# Altium project GSM_PCB_V4.PrjPcb
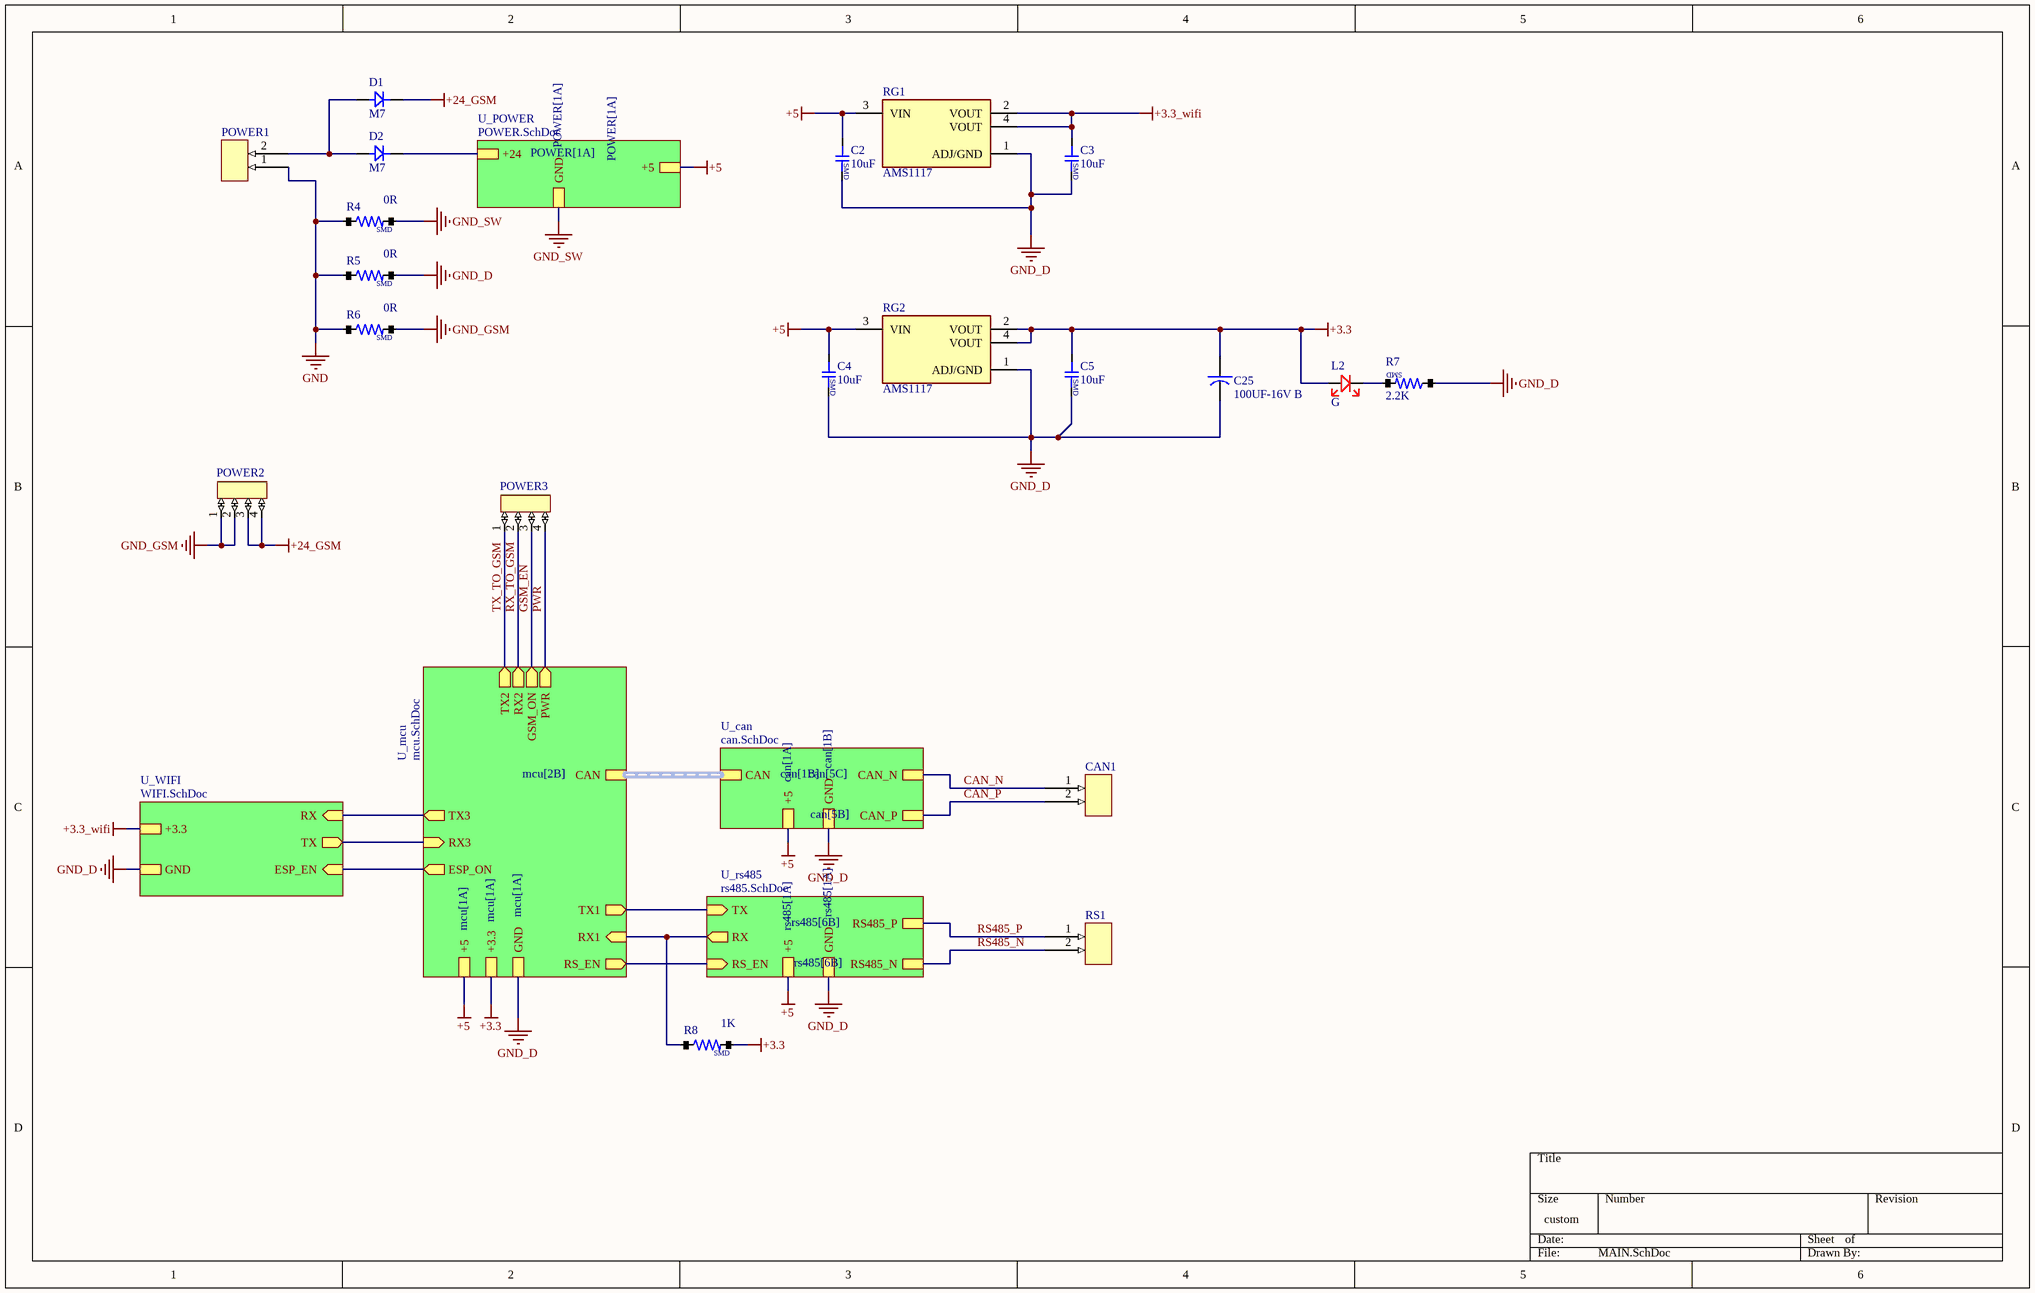
[diagram p0: MAIN.SchDoc]
7 sheets, 89 parts. Net scope: hierarchical (ports join the sheet entries above them; power ports are global).
Board file: GSM_PCB_V4.PcbDoc
Sheets:
  MAIN.SchDoc
    U_POWER = POWER.SchDoc
    U_rs485 = rs485.SchDoc
    U_mcu = mcu.SchDoc
      U_spi_flash = spi_flash.SchDoc
    U_can = can.SchDoc
    U_WIFI = WIFI.SchDoc

## Sheet MAIN.SchDoc
size 381 x 241 mm; SheetNumber: 1; SheetTotal: 7

### Parts
C2  10uF  [CAP-1206]
C3  10uF  [CAP-1206]
C4  10uF  [CAP-1206]
C5  10uF  [CAP-1206]
C25  100UF-16V B  [CAP_TANTAL_B]
CAN1  conector_2pin_power  [MSTBA 2,5]  (value not drawn)
D1  M7  [DIOD/1N4007/SMD]
D2  M7  [DIOD/1N4007/SMD]
L2  G  [LED/0805]
POWER1  (no value)  [CONECTOR/FONIX/2PIN]
POWER2  (no value)  [CONECTOR/XH/4PIN]
POWER3  (no value)  [CONECTOR/XH/4PIN]
R4  0R  [RES/0805]
R5  0R  [RES/0805]
R6  0R  [RES/0805]
R7  2.2K  [RES/0603]
R8  1K  [RES/0603]
RG1  AMS1117  [AMS1117]
RG2  AMS1117  [AMS1117]
RS1  conector_2pin_power  [MSTBA 2,5]  (value not drawn)

### Sub-sheets
U_can = can.SchDoc: GND, +5, CAN (harness CAN), CAN_P, CAN_N
U_mcu = mcu.SchDoc: GND, +5, +3.3, CAN (harness CAN), TX1 (out), RX1 (in), RS_EN (out), TX3 (out), RX3 (in), ESP_ON (out), TX2 (out), RX2 (out), PWR (out), GSM_ON (out)
U_POWER = POWER.SchDoc: GND, +24, +5
U_rs485 = rs485.SchDoc: GND, +5, RS485_N, RS485_P, TX (in), RS_EN (in), RX (out)
U_WIFI = WIFI.SchDoc: +3.3, GND, ESP_EN (in), RX (in), TX (out)

### Nets
+3.3: C3.1 C5.1 C25.+ L2.A R8.2 RG1.2(VOUT) RG1.4(VOUT) RG2.2(VOUT) RG2.4(VOUT) ; sheet U_mcu/+3.3, sheet U_WIFI/+3.3  [also labelled +3.3_wifi]
+5: C2.1 C4.1 RG1.3(VIN) RG2.3(VIN) ; sheet U_POWER/+5, sheet U_rs485/+5, sheet U_mcu/+5, sheet U_can/+5
+24: D2.K ; sheet U_POWER/+24
+24_GSM: D1.K POWER2.3 POWER2.4
GND: C2.2 C3.2 C4.2 C5.2 C25.- POWER1.1 R4.1 R4.2 R5.1 R5.2 R6.1 R7.1 RG1.1(ADJ/GND) RG2.1(ADJ/GND) ; sheet U_POWER/GND, sheet U_rs485/GND, sheet U_mcu/GND, sheet U_can/GND, sheet U_WIFI/GND  [also labelled GND_D, GND_SW]
GND_GSM: POWER2.1 POWER2.2 R6.2
CAN_N: CAN1.1 ; sheet U_can/CAN_N
CAN_P: CAN1.2 ; sheet U_can/CAN_P
ESP-RX: sheet U_mcu/TX3, sheet U_WIFI/RX
ESP_ON: sheet U_mcu/ESP_ON, sheet U_WIFI/ESP_EN
ESP_TX: sheet U_mcu/RX3, sheet U_WIFI/TX
GSM_EN: POWER3.3 ; sheet U_mcu/GSM_ON
PWR: POWER3.4 ; sheet U_mcu/PWR
RS485_N: RS1.2 ; sheet U_rs485/RS485_N
RS485_P: RS1.1 ; sheet U_rs485/RS485_P
RS_EN: sheet U_rs485/RS_EN, sheet U_mcu/RS_EN
RX: R8.1 ; sheet U_rs485/RX, sheet U_mcu/RX1
RX_TO_GSM: POWER3.2 ; sheet U_mcu/RX2
TX: sheet U_rs485/TX, sheet U_mcu/TX1
TX_TO_GSM: POWER3.1 ; sheet U_mcu/TX2
NetD1_A: D1.A D2.A POWER1.2
NetL2_K: L2.K R7.2

### Buses and harness runs
harness sheet U_can/CAN = sheet U_mcu/CAN

### Notes on the sheet
- (in symbol cap_smd) SMD
- (in symbol RES/SMD) SMD

### Library data of the parts
C2-C5 = cap_smd
C25 = cap-electrolit
D1 D2 = DIOD/RECTIFIERS
L2 = LED-1COLER
POWER1 = CONECTOR/FONIX/2PIN
POWER2 POWER3 = CONECTOR/XH/4PIN
R4-R8 = RES/SMD

## Sheet POWER.SchDoc
size A; SheetNumber: 2; SheetTotal: 7
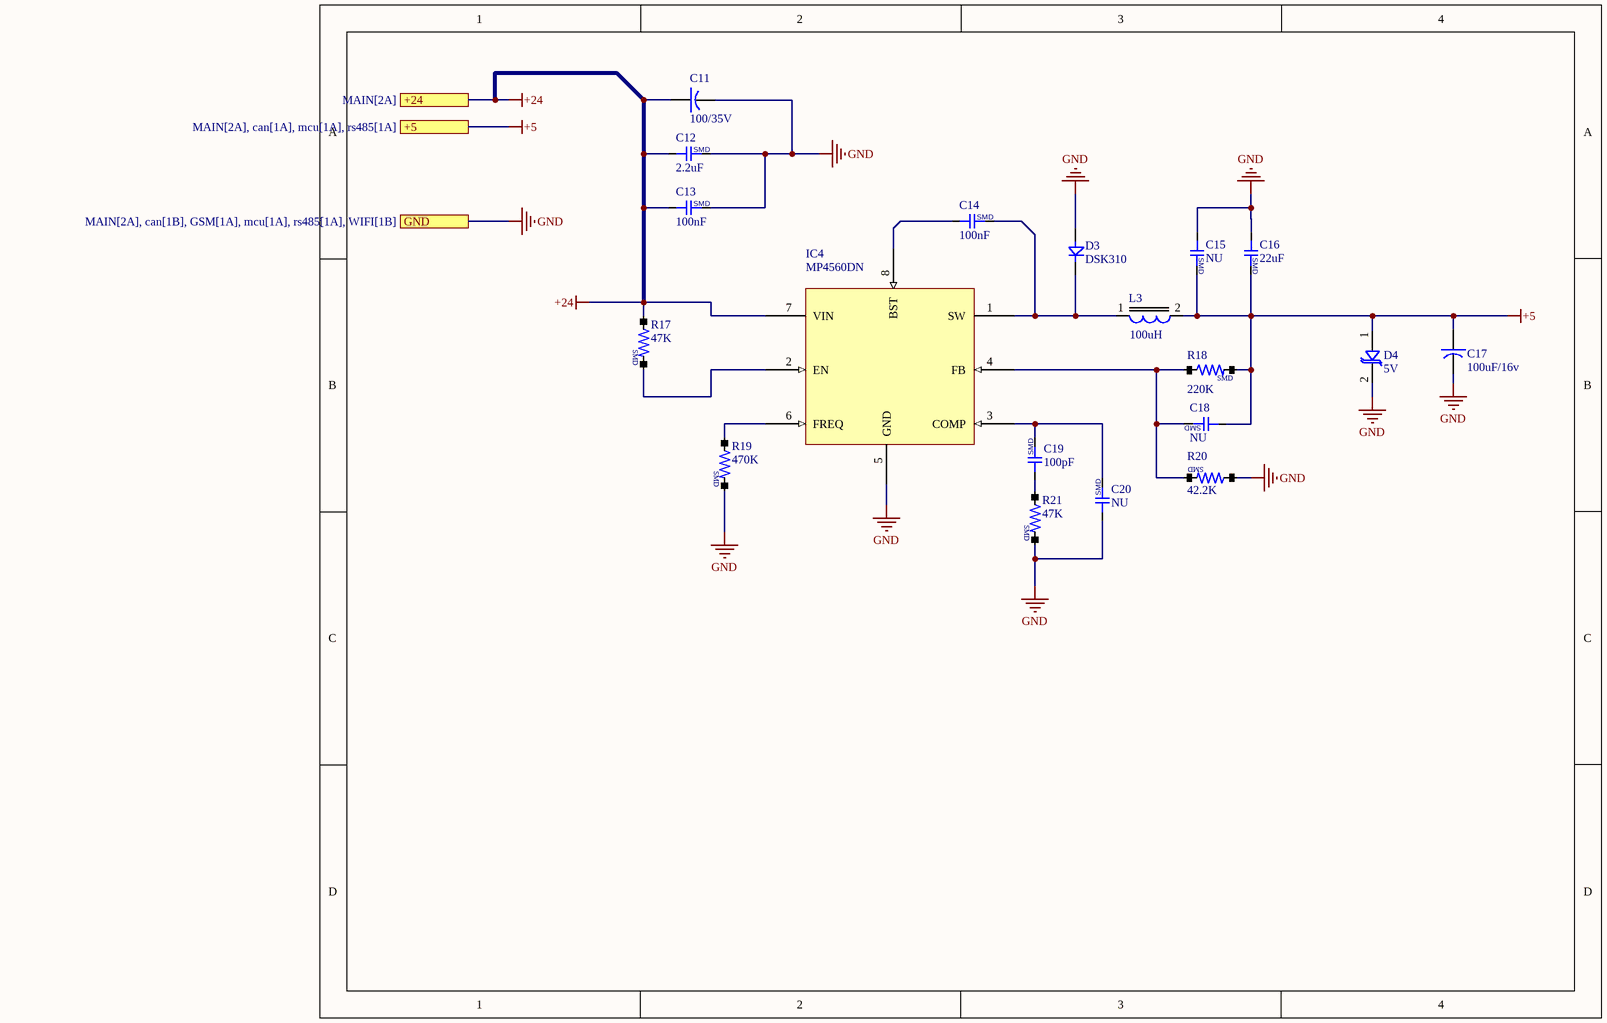
[diagram p1: POWER.SchDoc]

### Parts
C11  100/35V  [cap/330u/16v]
C12  2.2uF  [CAP-0805]
C13  100nF  [CAP-0603]
C14  100nF  [CAP-0603]
C15  NU  [CAP-1206]
C16  22uF  [CAP-1206]
C17  100uF/16v  [cap/330u/16v]
C18  NU  [CAP-0603]
C19  100pF  [CAP-0603]
C20  NU  [CAP-0603]
D3  DSK310  [DIOD/1N4007/SMD]
D4  5V  [TVS-5V-SMD]
IC4  MP4560DN  [SOP8_HIT]
L3  100uH  [inductor-9*12]
R17  47K  [RES/0603]
R18  220K  [RES/0603]
R19  470K  [RES/0603]
R20  42.2K  [RES/0603]
R21  47K  [RES/0603]

### Ports
+5 (see MAIN[2A], can[1A], mcu[1A], rs485[1A]), +24 (see MAIN[2A]), GND (see MAIN[2A], can[1B], GSM[1A], mcu[1A], rs485[1A], WIFI[1B])

### Nets
+5: C15.2 C16.2 C17.+ C18.1 D4.1 L3.2 R18.2 ; port +5
+24: C11.+ C12.1 C13.1 IC4.7(VIN) R17.1 ; port +24
GND: C11.- C12.2 C13.2 C15.1 C16.1 C17.- C20.1 D3.A D4.2 IC4.5(GND) R19.2 R20.1 R21.2 ; port GND
NetC14_1: C14.1 IC4.8(BST)
NetC14_2: C14.2 D3.K IC4.1(SW) L3.1
NetC18_2: C18.2 IC4.4(FB) R18.1 R20.2
NetC19_1: C19.1 R21.1
NetC19_2: C19.2 C20.2 IC4.3(COMP)
NetIC4_2: IC4.2(EN) R17.2
NetIC4_6: IC4.6(FREQ) R19.1

### Notes on the sheet
- (in symbol cap_smd) SMD
- (in symbol RES/SMD) SMD

### Library data of the parts
C11 C17 = cap-electrolit
C12-C16 C18-C20 = cap_smd
D3 = DIOD/RECTIFIERS
D4 = TVS-SMD
L3 = inductor
R17-R21 = RES/SMD

## Sheet rs485.SchDoc
size 228 x 165 mm; SheetNumber: 3; SheetTotal: 7
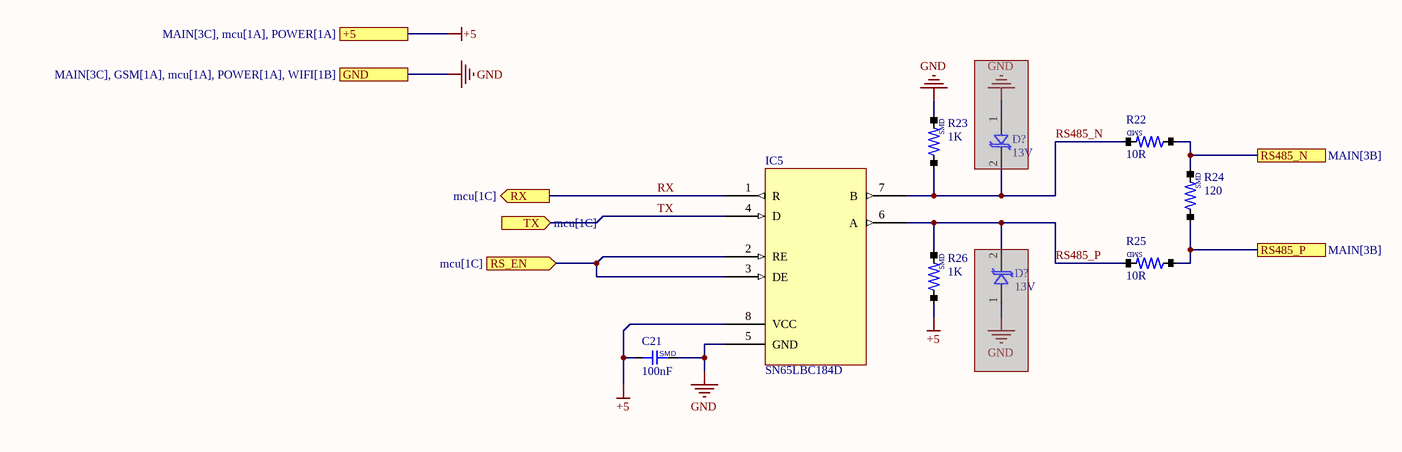
[diagram p2: rs485.SchDoc]

### Parts
(Parts that share a designator on the sheet are numbered #1, #2 ... from top to bottom, then left to right.)
C21  100nF  [CAP-0603]
D?#1  13V  [TVS-5V-SMD]  (masked out: inside a compile mask, not in the netlist)
D?#2  13V  [TVS-5V-SMD]  (masked out: inside a compile mask, not in the netlist)
IC5  SN65LBC184D  [SOP-8]
R22  10R  [RES/1206]
R23  1K  [RES/0603]
R24  120  [RES/1206]
R25  10R  [RES/1206]
R26  1K  [RES/0603]

### Ports
+5 (see MAIN[3C], mcu[1A], POWER[1A]), GND (see MAIN[3C], GSM[1A], mcu[1A], POWER[1A], WIFI[1B]), RS485_N (see MAIN[3B]), RS485_P (see MAIN[3B]), RS_EN (in, see mcu[1C]), RX (out, see mcu[1C]), TX (in, see mcu[1C])

### Nets
+5: C21.1 IC5.8(VCC) R26.1 ; port +5
GND: C21.2 IC5.5(GND) R23.2 ; port GND
RS485_N: R22.1 R24.2 ; port RS485_N
RS485_N: IC5.7(B) R22.2 R23.1  [project net RS485_N_3]  [a separate net that carries the same name]
RS485_P: R24.1 R25.1 ; port RS485_P
RS485_P: IC5.6(A) R25.2 R26.2  [project net RS485_P_3]  [a separate net that carries the same name]
RS_EN: IC5.2(RE) IC5.3(DE) ; port RS_EN
RX: IC5.1(R) ; port RX
TX: IC5.4(D) ; port TX

### Notes on the sheet
- (in symbol cap_smd) SMD
- (in symbol RES/SMD) SMD

### Library data of the parts
C21 = cap_smd
D?#1 D?#2 = TVS-SMD
R22-R26 = RES/SMD

## Sheet mcu.SchDoc
size 762 x 508 mm; SheetNumber: 5; SheetTotal: 7
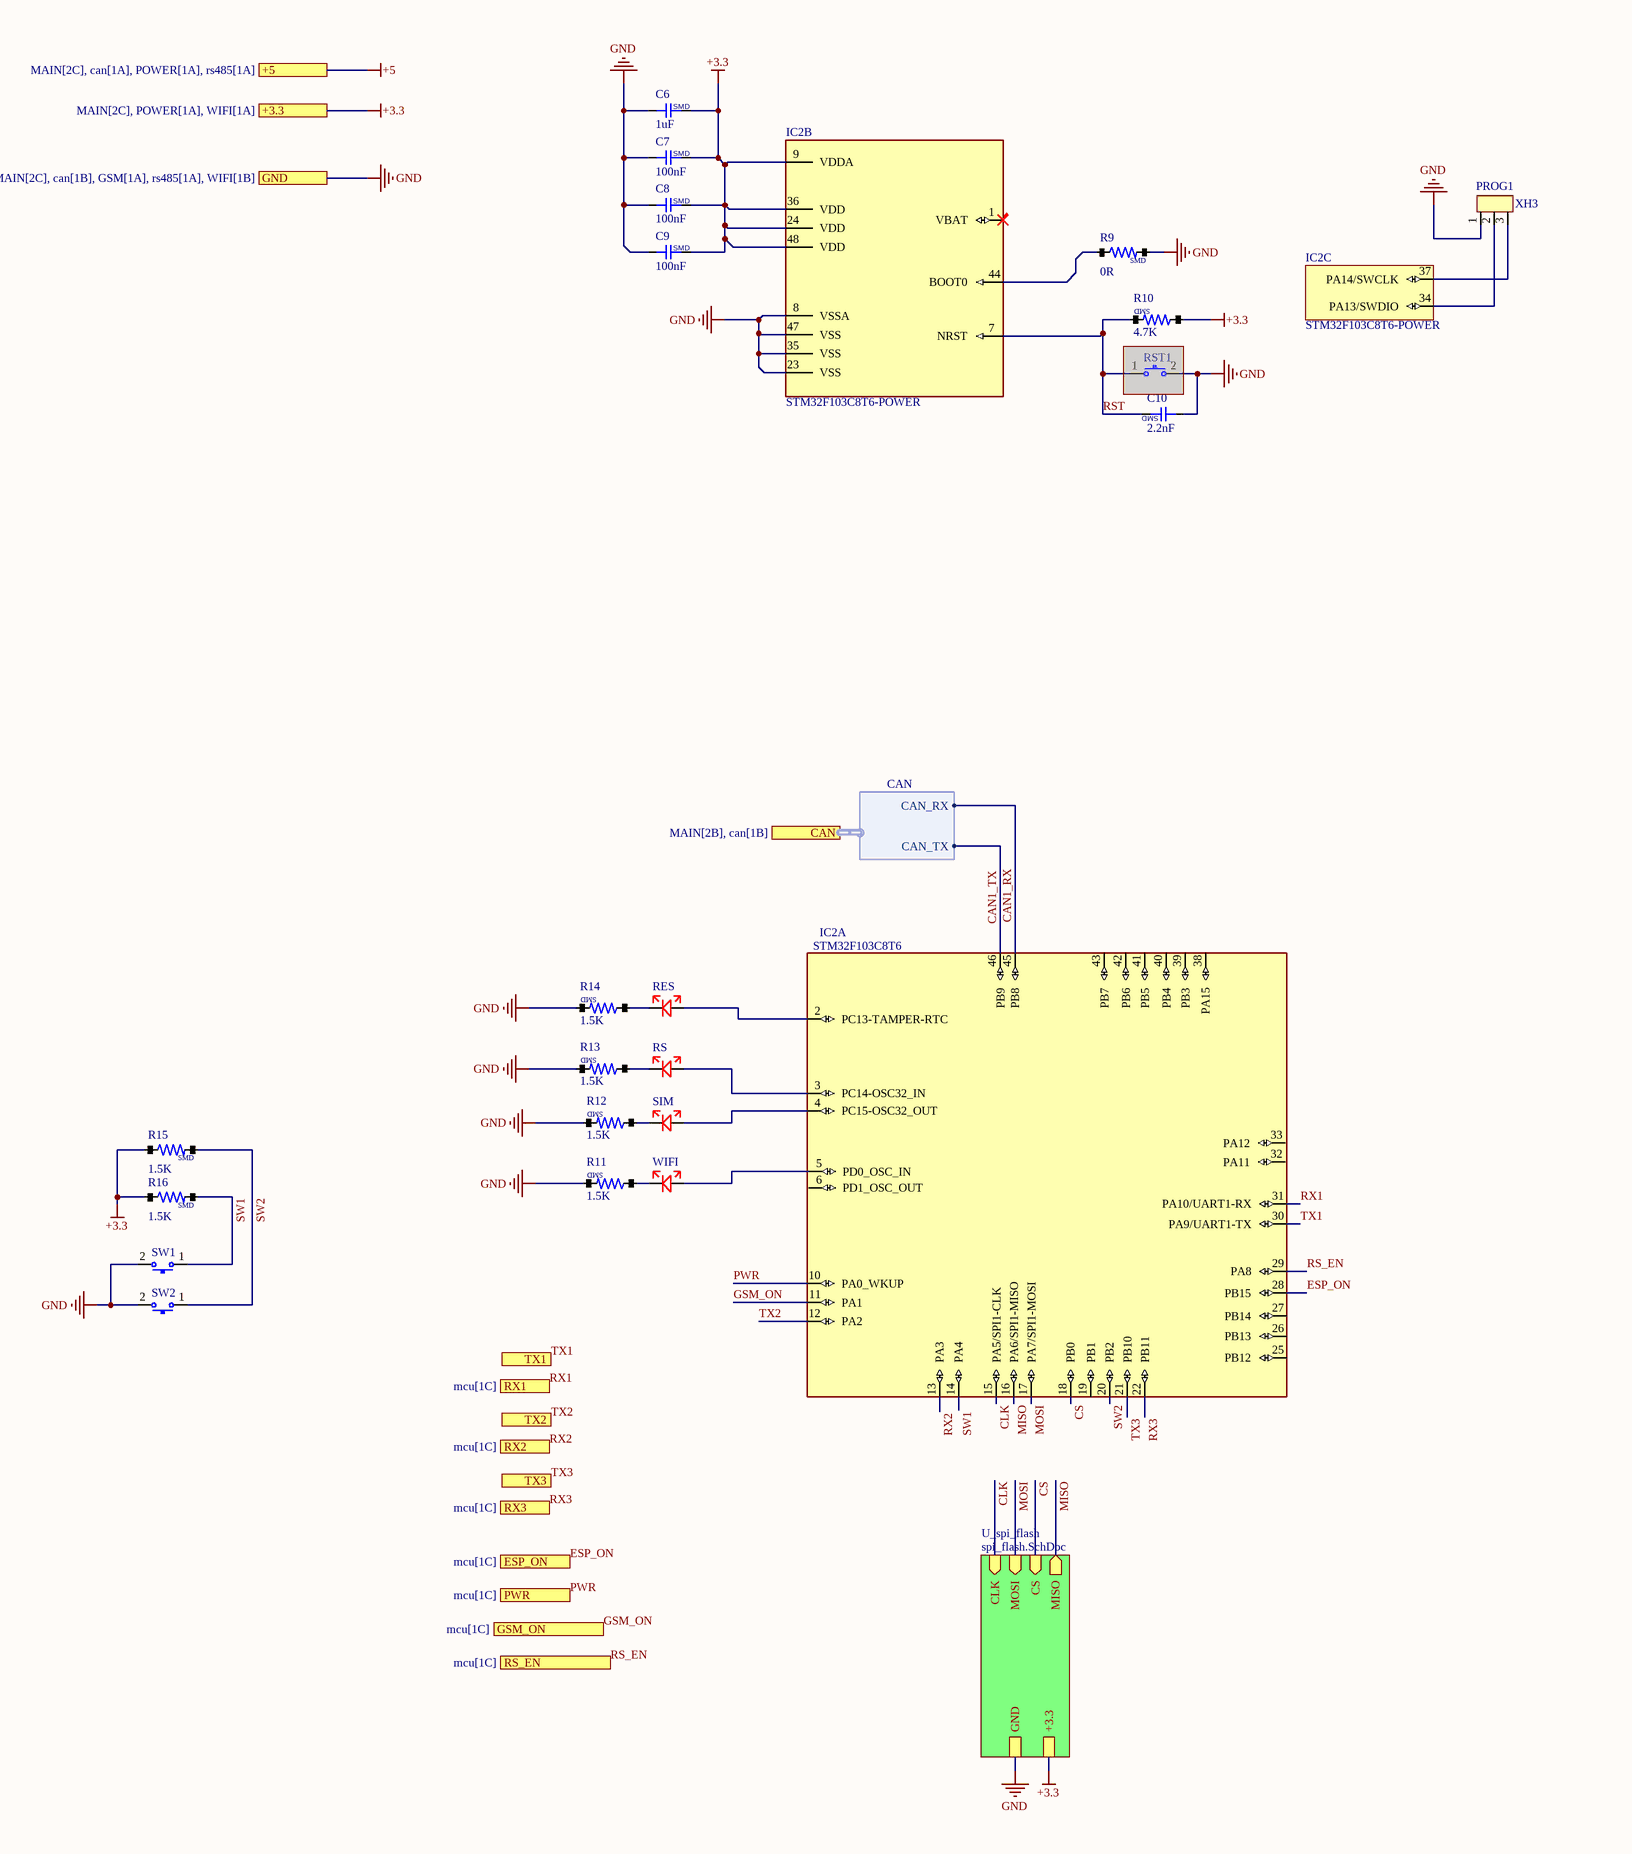
[diagram p3: mcu.SchDoc, left]

### Parts
C6  1uF  [CAP-0805]
C7  100nF  [CAP-0603]
C8  100nF  [CAP-0603]
C9  100nF  [CAP-0603]
C10  2.2nF  [CAP-0603]
IC2  STM32F103C8T6  [LQFP48-7x7-0.50]  (parts A,B,C of 3)
PROG1  XH3  [XH3]
R9  0R  [RES/0603]
R10  4.7K  [RES/0603]
R11  1.5K  [RES/0603]
R12  1.5K  [RES/0603]
R13  1.5K  [RES/0603]
R14  1.5K  [RES/0603]
R15  1.5K  [RES/0603]
R16  1.5K  [RES/0603]
RES  (no value)  [LED/0805]
RS  (no value)  [LED/0805]
RST1  (no value)  [micro-sw-little]  (masked out: inside a compile mask, not in the netlist)
SIM  (no value)  [LED/0805]
SW1  (no value)  [micro_switch_smd]
SW2  (no value)  [micro_switch_smd]
WIFI  (no value)  [LED/0805]

### Sub-sheets
U_spi_flash = spi_flash.SchDoc: GND, +3.3, CS (in), MISO (out), MOSI (in), CLK (in)

### Ports
+3.3 (see MAIN[2C], POWER[1A], WIFI[1A]), +5 (see MAIN[2C], can[1A], POWER[1A], rs485[1A]), CAN (harness CAN, see MAIN[2B], can[1B]), ESP_ON (out, see mcu[1C]), GND (see MAIN[2C], can[1B], GSM[1A], rs485[1A], WIFI[1B]), GSM_ON (out, see mcu[1C]), PWR (out, see mcu[1C]), RS_EN (out, see mcu[1C]), RX1 (in, see mcu[1C]), RX2 (in, see mcu[1C]), RX3 (in, see mcu[1C]), TX1 (out), TX2 (out), TX3 (out)

### Harnesses
CAN: CAN_RX, CAN_TX

### Nets
+3.3: C6.2 C7.2 C8.2 C9.2 IC2.9(VDDA) IC2.24(VDD) IC2.36(VDD) IC2.48(VDD) R10.1 R15.1 R16.1 ; port +3.3, sheet U_spi_flash/+3.3
GND: C6.1 C7.1 C8.1 C9.1 C10.1 IC2.8(VSSA) IC2.23(VSS) IC2.35(VSS) IC2.47(VSS) PROG1.1 R9.2 R11.2 R12.2 R13.2 R14.2 SW1.2 SW2.2 ; port GND, sheet U_spi_flash/GND
CAN1_RX: IC2.45(PB8) ; port CAN.CAN_RX
CAN1_TX: IC2.46(PB9) ; port CAN.CAN_TX
CLK: IC2.15(PA5/SPI1-CLK) ; sheet U_spi_flash/CLK
CS: IC2.18(PB0) ; sheet U_spi_flash/CS
ESP_ON: IC2.28(PB15) ; port ESP_ON
GSM_ON: IC2.11(PA1) ; port GSM_ON  [project net GSM_EN]
MISO: IC2.16(PA6/SPI1-MISO) ; sheet U_spi_flash/MISO
MOSI: IC2.17(PA7/SPI1-MOSI) ; sheet U_spi_flash/MOSI
PWR: IC2.10(PA0_WKUP) ; port PWR
RS_EN: IC2.29(PA8) ; port RS_EN
RST: C10.2 IC2.7(NRST) R10.2  [project net RST_5]
RX1: IC2.31(PA10/UART1-RX) ; port RX1  [project net RX]
RX2: IC2.13(PA3) ; port RX2  [project net RX_TO_GSM]
RX3: IC2.22(PB11) ; port RX3  [project net ESP_TX]
SW1: IC2.14(PA4) R16.2 SW1.1  [project net SW1_5]
SW2: IC2.20(PB2) R15.2 SW2.1  [project net SW2_5]
TX1: IC2.30(PA9/UART1-TX) ; port TX1  [project net TX]
TX2: IC2.12(PA2) ; port TX2  [project net TX_TO_GSM]
TX3: IC2.21(PB10) ; port TX3  [project net ESP-RX]
NetIC2_2: IC2.2(PC13-TAMPER-RTC) RES.A
NetIC2_3: IC2.3(PC14-OSC32_IN) RS.A
NetIC2_4: IC2.4(PC15-OSC32_OUT) SIM.A
NetIC2_5: IC2.5(PD0_OSC_IN) WIFI.A
NetIC2_34: IC2.34(PA13/SWDIO) PROG1.2
NetIC2_37: IC2.37(PA14/SWCLK) PROG1.3
NetIC2_44: IC2.44(BOOT0) R9.1
NetR11_1: R11.1 WIFI.K
NetR12_1: R12.1 SIM.K
NetR13_1: R13.1 RS.K
NetR14_1: R14.1 RES.K

Not connected (* = marked no-connect by the designer): IC2 1(VBAT)* 6(PD1_OSC_OUT) 19(PB1) 25(PB12) 26(PB13) 27(PB14) 32(PA11) 33(PA12) 38(PA15) 39(PB3) 40(PB4) 41(PB5) 42(PB6) 43(PB7)

### Layout directives
net class IC: (no net found under the mark)

### Notes on the sheet
- (in symbol cap_smd) SMD
- (in symbol RES/SMD) SMD

### Library data of the parts
C6-C10 = cap_smd
R9-R16 = RES/SMD
RES RS SIM WIFI = LED-1COLER
RST1 SW1 SW2 = micro_sw

## Sheet spi_flash.SchDoc
size A
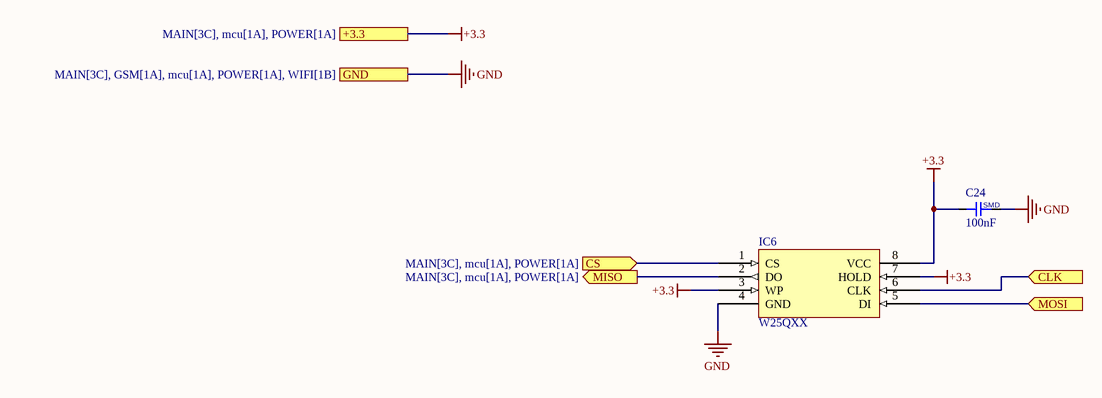
[diagram p4: spi_flash.SchDoc]

### Parts
C24  100nF  [CAP-0603]
IC6  W25QXX  [SOIC-8PIN-280MIL]

### Ports
+3.3 (see MAIN[3C], mcu[1A], POWER[1A]), CLK (in), CS (in, see MAIN[3C], mcu[1A], POWER[1A]), GND (see MAIN[3C], GSM[1A], mcu[1A], POWER[1A], WIFI[1B]), MISO (out, see MAIN[3C], mcu[1A], POWER[1A]), MOSI (in)

### Nets
+3.3: C24.1 IC6.3(WP) IC6.7(HOLD) IC6.8(VCC) ; port +3.3
GND: C24.2 IC6.4(GND) ; port GND
CLK: IC6.6(CLK) ; port CLK
CS: IC6.1(CS) ; port CS
MISO: IC6.2(DO) ; port MISO
MOSI: IC6.5(DI) ; port MOSI

### Notes on the sheet
- (in symbol cap_smd) SMD

### Library data of the parts
C24 = cap_smd

## Sheet can.SchDoc
size 203 x 139 mm; SheetNumber: 6; SheetTotal: 6
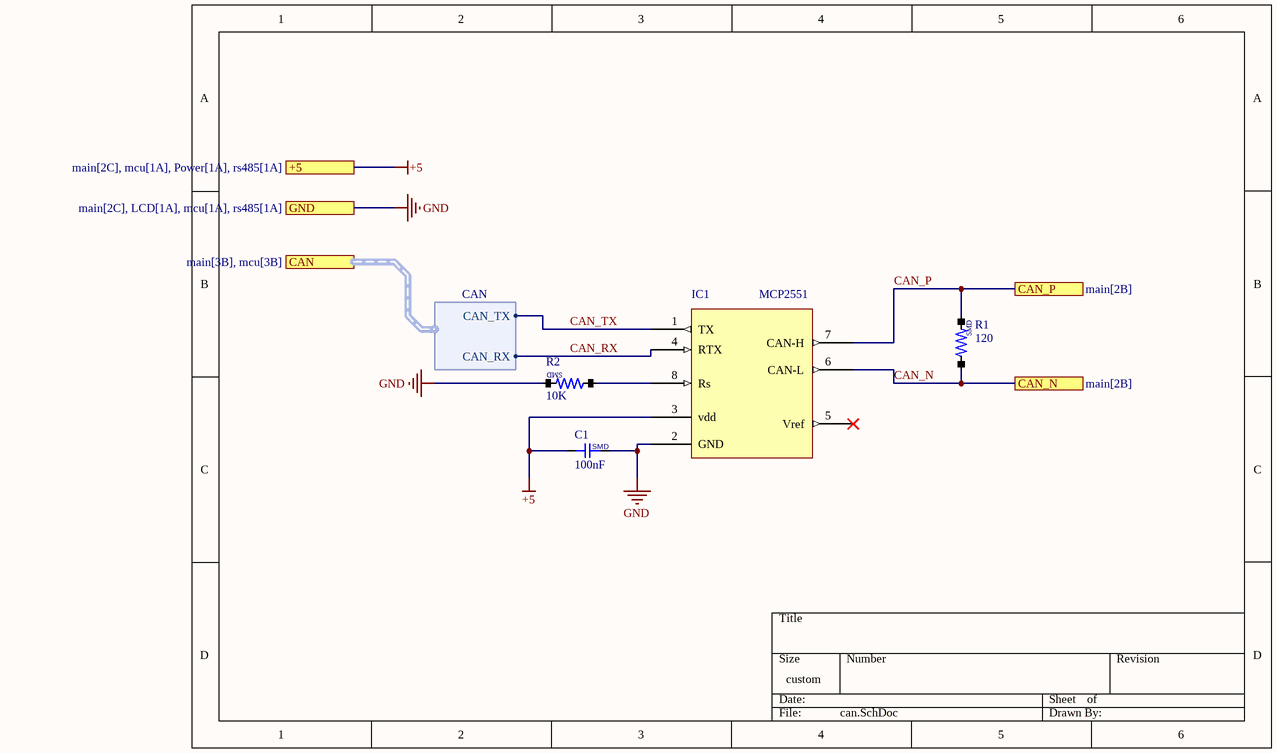
[diagram p5: can.SchDoc]

### Parts
C1  100nF  [CAP-0603]
IC1  MCP2551  [SOP-8]
R1  120  [RES/1206]
R2  10K  [RES/0603]

### Ports
+5 (see main[2C], mcu[1A], Power[1A], rs485[1A]), CAN (harness CAN, see main[3B], mcu[3B]), CAN_N (see main[2B]), CAN_P (see main[2B]), GND (see main[2C], LCD[1A], mcu[1A], rs485[1A])

### Harnesses
CAN: CAN_RX, CAN_TX

### Nets
+5: C1.1 IC1.3(vdd) ; port +5
GND: C1.2 IC1.2(GND) R2.2 ; port GND
CAN_N: IC1.6(CAN-L) R1.1 ; port CAN_N
CAN_P: IC1.7(CAN-H) R1.2 ; port CAN_P
CAN_RX: IC1.4(RTX) ; port CAN.CAN_RX  [project net CAN1_RX]
CAN_TX: IC1.1(TX) ; port CAN.CAN_TX  [project net CAN1_TX]
NetIC1_8: IC1.8(Rs) R2.1

Not connected (* = marked no-connect by the designer): IC1 5(Vref)*

### Notes on the sheet
- (in symbol cap_smd) SMD
- (in symbol RES/SMD) SMD

### Library data of the parts
C1 = cap_smd
R1 R2 = RES/SMD

## Sheet WIFI.SchDoc
size A; SheetNumber: 6; SheetTotal: 7
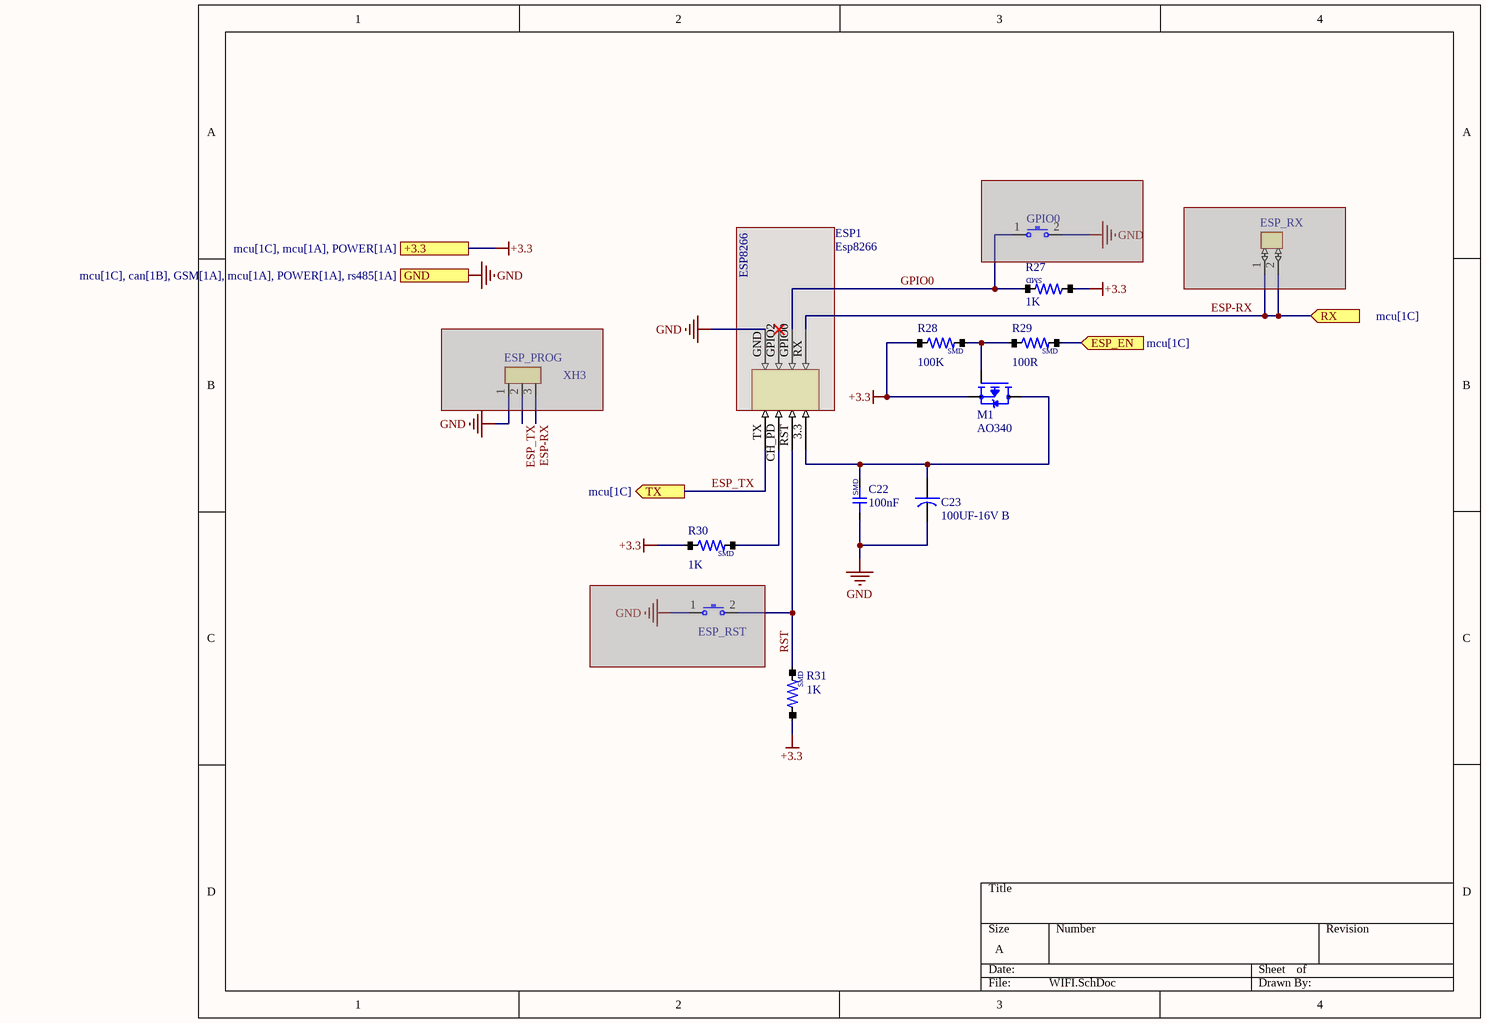
[diagram p6: WIFI.SchDoc]

### Parts
C22  100nF  [CAP-0603]
C23  100UF-16V B  [CAP_TANTAL_B]
ESP1  Esp8266  [ESP8266]
ESP_PROG  XH3  [XH3]  (masked out: inside a compile mask, not in the netlist)
ESP_RST  (no value)  [micro-sw-little]  (masked out: inside a compile mask, not in the netlist)
ESP_RX  CONECTOR/XH/2PIN  [CONECTOR/XH/2PIN]  (value not drawn)  (masked out: inside a compile mask, not in the netlist)
GPIO0  (no value)  [micro-sw-little]  (masked out: inside a compile mask, not in the netlist)
M1  AO340  [AO3401A]
R27  1K  [RES/0603]
R28  100K  [RES/0603]
R29  100R  [RES/0603]
R30  1K  [RES/0603]
R31  1K  [RES/0603]

### Ports
+3.3 (see mcu[1C], mcu[1A], POWER[1A]), ESP_EN (in, see mcu[1C]), GND (see mcu[1C], can[1B], GSM[1A], mcu[1A], POWER[1A], rs485[1A]), RX (in, see mcu[1C]), TX (out, see mcu[1C])

### Nets
+3.3: M1.S R27.1 R28.1 R30.1 R31.1 ; port +3.3
GND: C22.1 C23.- ESP1.GND ; port GND
ESP-RX: ESP1.RX ; port RX
ESP_ON: R29.2 ; port ESP_EN
ESP_TX: ESP1.TX ; port TX
GPIO0: ESP1.GPIO0 R27.2  [project net GPIO0_6]
RST: ESP1.RST R31.2  [project net RST_6]
NetC22_2: C22.2 C23.+ ESP1.3.3 M1.D
NetESP1_CH_PD: ESP1.CH_PD R30.2
NetM1_G: M1.G R28.2 R29.1

Not connected (* = marked no-connect by the designer): ESP1 GPIO2*

### Notes on the sheet
- (in symbol cap_smd) SMD
- (in symbol Esp8266) ESP8266
- (in symbol RES/SMD) SMD

### Library data of the parts
C22 = cap_smd
C23 = cap-electrolit
ESP_RST GPIO0 = micro_sw
M1 = MOSFET_P_CH
R27-R31 = RES/SMD

## Nets that join several sheets
+3.3: MAIN (9 pins), mcu (11 pins), spi_flash (C24.1 IC6.3 IC6.7 IC6.8), WIFI (5 pins)
+5: MAIN (C2.1 C4.1 RG1.3 RG2.3), POWER (7 pins), rs485 (C21.1 IC5.8 R26.1), can (C1.1 IC1.3)
+24: MAIN (D2.K), POWER (5 pins)
GND: MAIN (14 pins), POWER (13 pins), rs485 (C21.2 IC5.5 R23.2), mcu (17 pins), spi_flash (C24.2 IC6.4), can (C1.2 IC1.2 R2.2), WIFI (C22.1 C23.- ESP1.GND)
CAN1_RX: mcu (IC2.45), can (IC1.4)
CAN1_TX: mcu (IC2.46), can (IC1.1)
CAN_N: MAIN (CAN1.1), can (IC1.6 R1.1)
CAN_P: MAIN (CAN1.2), can (IC1.7 R1.2)
CLK: mcu (IC2.15), spi_flash (IC6.6)
CS: mcu (IC2.18), spi_flash (IC6.1)
ESP-RX: mcu (IC2.21), WIFI (ESP1.RX)
ESP_ON: mcu (IC2.28), WIFI (R29.2)
ESP_TX: mcu (IC2.22), WIFI (ESP1.TX)
GSM_EN: MAIN (POWER3.3), mcu (IC2.11)
MISO: mcu (IC2.16), spi_flash (IC6.2)
MOSI: mcu (IC2.17), spi_flash (IC6.5)
PWR: MAIN (POWER3.4), mcu (IC2.10)
RS485_N: MAIN (RS1.2), rs485 (R22.1 R24.2)
RS485_P: MAIN (RS1.1), rs485 (R24.1 R25.1)
RS_EN: rs485 (IC5.2 IC5.3), mcu (IC2.29)
RX: MAIN (R8.1), rs485 (IC5.1), mcu (IC2.31)
RX_TO_GSM: MAIN (POWER3.2), mcu (IC2.13)
TX: rs485 (IC5.4), mcu (IC2.30)
TX_TO_GSM: MAIN (POWER3.1), mcu (IC2.12)